# EAGLE design Loginator 1.1 (EAGLE 6.5.0)
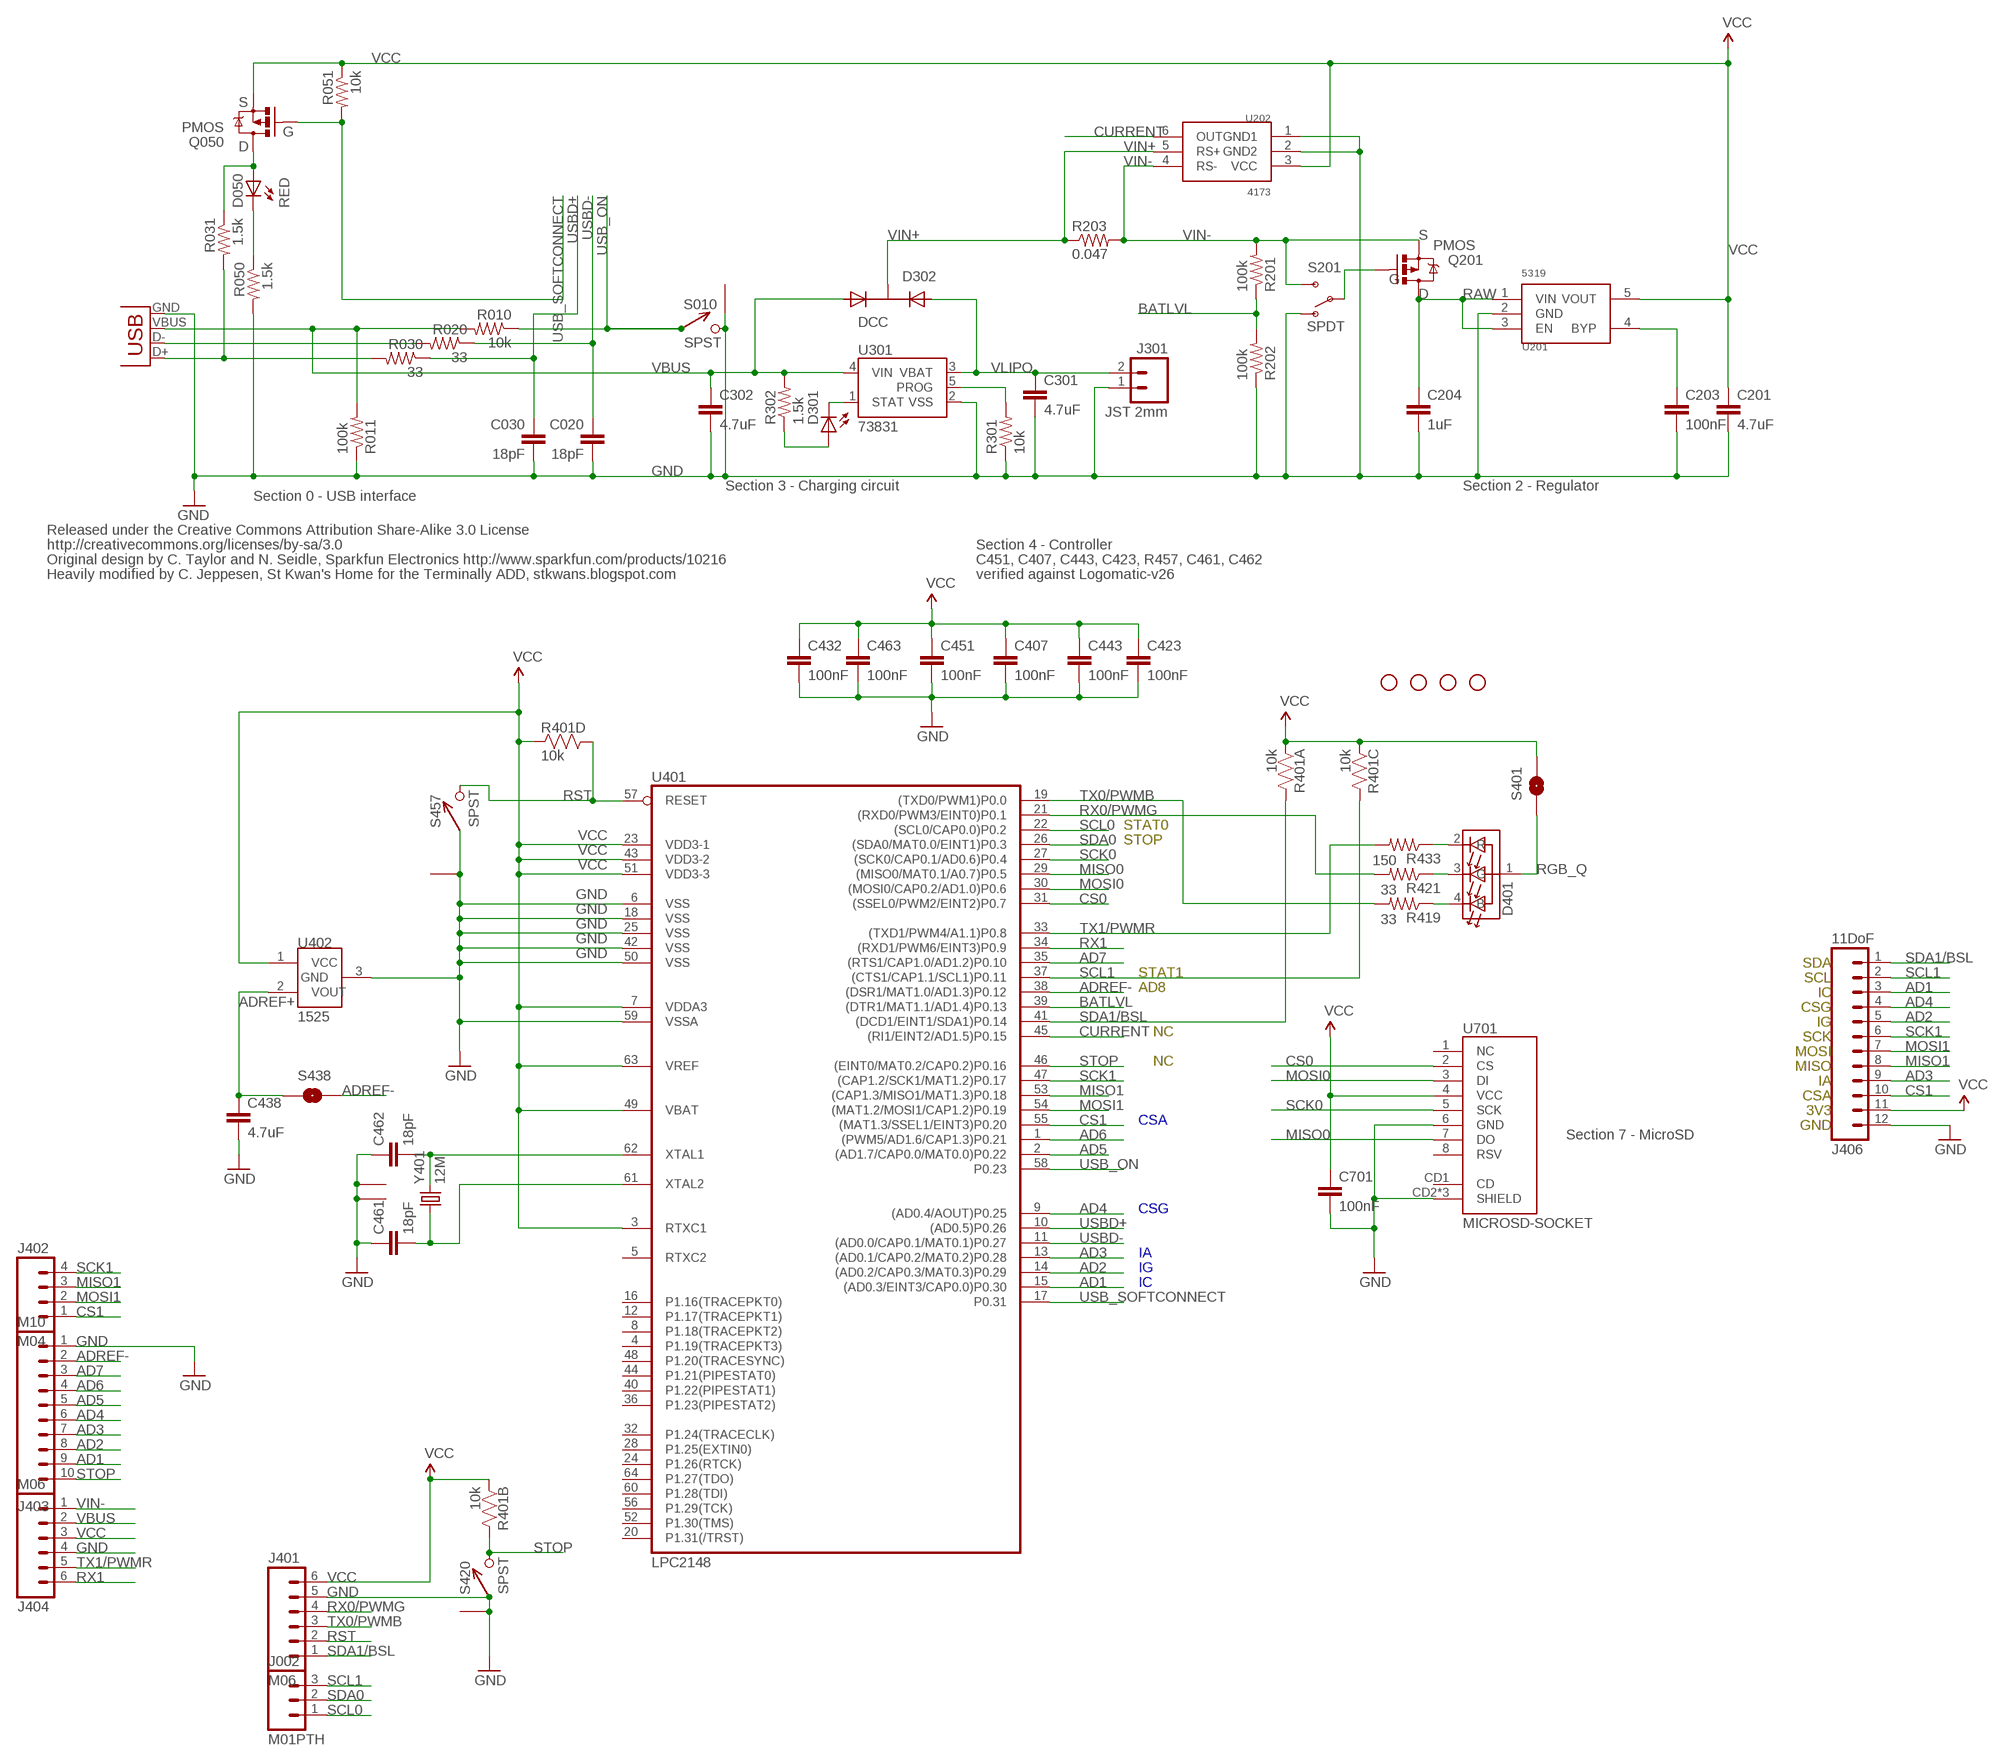
[diagram p0: schematic, sheet 1]

## Parts
C020  18pF  CAP0402-CAP  [0402-CAP]
C030  18pF  CAP0402-CAP  [0402-CAP]
C201  4.7uF  CAP0402-CAP  [0402-CAP]
C203  100nF  CAP0402-CAP  [0402-CAP]
C204  1uF  CAP0402-CAP  [0402-CAP]
C301  4.7uF  CAP0402-CAP  [0402-CAP]
C302  4.7uF  CAP0402-CAP  [0402-CAP]
C407  100nF  CAP0402-CAP  [0402-CAP]
C423  100nF  CAP0402-CAP  [0402-CAP]
C432  100nF  CAP0402-CAP  [0402-CAP]
C438  4.7uF  CAP0402-CAP  [0402-CAP]
C443  100nF  CAP0402-CAP  [0402-CAP]
C451  100nF  CAP0402-CAP  [0402-CAP]
C461  18pF  CAP0402-CAP  [0402-CAP]
C462  18pF  CAP0402-CAP  [0402-CAP]
C463  100nF  CAP0402-CAP  [0402-CAP]
C701  100nF  CAP0402-CAP  [0402-CAP]
D050  RED  LED0603  [LED-0603]
D301  RED  LED0603  [LED-0603]
D302  DCC  PMEG2005CT  [SOT-23-3]
D401  HSMF-C118  [HSMF-C118]
J001  USBSMD  [USB-MINIB]
J002  M01PTH  M03PTH  [1X03]
J301  JST 2mm  M02-JST-2MM-SMT  [JST-2-SMD]
J401  M06  M06SIP  [1X06]
J402  M04  M04PTH  [1X04]
J403  M10  M10"  [1X10]
J404  M06  M06SIP  [1X06]
J406  11DoF  M12PTH  [1X12]
JP1  STAND-OFF  [STAND-OFF]
JP2  STAND-OFF  [STAND-OFF]
JP3  STAND-OFF  [STAND-OFF]
JP4  STAND-OFF  [STAND-OFF]
Q050  PMOS  MOSFET-PCHANNELSMD  [SOT23-3]
Q201  PMOS  MOSFET-PCHANNELSMD  [SOT23-3]
R010  10k  RESISTOR0402-RES  [0402-RES]
R011  100k  RESISTOR0402-RES  [0402-RES]
R020  33  RESISTOR0402-RES  [0402-RES]
R030  33  RESISTOR0402-RES  [0402-RES]
R031  1.5k  RESISTOR0402-RES  [0402-RES]
R050  1.5k  RESISTOR0402-RES  [0402-RES]
R051  10k  RESISTOR0402-RES  [0402-RES]
R201  100k  RESISTOR0402-RES  [0402-RES]
R202  100k  RESISTOR0402-RES  [0402-RES]
R203  0.047  RESISTOR0402-RES  [0402-RES]
R301  10k  RESISTOR0402-RES  [0402-RES]
R302  1.5k  RESISTOR0402-RES  [0402-RES]
R401  10k  RP404  [CRA04]
R419  33  RESISTOR0402-RES  [0402-RES]
R421  33  RESISTOR0402-RES  [0402-RES]
R433  150  RESISTOR0402-RES  [0402-RES]
S010  SPST  B3U-1100P  [B3U-1100P]
S201  SPDT  SWITCH-SPSTSMD  [AYZ0202]
S401  SOLDERJUMPERNO  [SJ_2S-NO]
S420  SPST  B3U-1100P  [B3U-1100P]
S438  SOLDERJUMPERNO  [SJ_2S-NO]
S457  SPST  B3U-1100P  [B3U-1100P]
U201  5319  MIC5319D5  [SOT-23-5]
U202  4173  MAX4173  [SOT-23-6]
U301  73831  MCP73831  [SOT23-5]
U401  LPC2148  LPC213X  [SQFP-S-10X10-64]
U402  1525  MCP1525  [SOT-23-3]
U701  MICROSD-SOCKET  [MICROSD-SOCKET-PP]
Y401  12M  TSX-3225  [CRYSTAL_SMD]

## Nets
AD1: J403.9 J406.3 U401.15((AD0.3/EINT3/CAP0.0)P0.30)
AD2: J403.8 J406.5 U401.14((AD0.2/CAP0.3/MAT0.3)P0.29)
AD3: J403.7 J406.9 U401.13((AD0.1/CAP0.2/MAT0.2)P0.28)
AD4: J403.6 J406.4 U401.9((AD0.4/AOUT)P0.25)
AD5: J403.5 U401.2((AD1.7/CAP0.0/MAT0.0)P0.22)
AD6: J403.4 U401.1((PWM5/AD1.6/CAP1.3)P0.21)
AD7: J403.3 U401.35((RTS1/CAP1.0/AD1.2)P0.10)
ADREF+: C438.1 S438.1 U402.2(VOUT)
ADREF-: J403.2 S438.2 U401.38((DSR1/MAT1.0/AD1.3)P0.12)
BATLVL: R201.1 R202.2 U401.39((DTR1/MAT1.1/AD1.4)P0.13)
CONN_D+: J001.D+ R030.2 R031.2
CONN_D-: J001.D- R020.2
CS0: U401.31((SSEL0/PWM2/EINT2)P0.7) U701.2(CS)
CS1: J402.1 J406.10 U401.55((MAT1.3/SSEL1/EINT3)P0.20)
CURRENT: U202.6(OUT) U401.45((RI1/EINT2/AD1.5)P0.15)
DB: D401.4(B) R419.1
DG: D401.3(G) R421.1
DR: D401.2(R) R433.1
GND: C020.2 C030.2 C201.2 C203.2 C204.2 C301.2 C302.2 C407.2 C423.2 C432.2 C438.2 C443.2 C451.2 C461.1 C462.1 C463.2 C701.2 J001.GND J301.1 J401.5 J403.1 J404.4 J406.12 R011.1 R050.2 R202.1 R301.1 S010.P$2 S010.P$3 S201.1(O) S420.P$1 S420.P$3 S457.P$1 S457.P$3 U201.2(GND) U202.1(GND1) U202.2(GND2) U301.2(VSS) U401.6(VSS) U401.18(VSS) U401.25(VSS) U401.42(VSS) U401.50(VSS) U401.59(VSSA) U402.3(GND) U701.6(GND) U701.CD2(SHIELD) U701.GND1(SHIELD) U701.GND3(SHIELD) Y401.2 Y401.4
MISO0: U401.29((MISO0/MAT0.1/A0.7)P0.5) U701.7(DO)
MISO1: J402.3 J406.8 U401.53((CAP1.3/MISO1/MAT1.3)P0.18)
MOSI0: U401.30((MOSI0/CAP0.2/AD1.0)P0.6) U701.3(DI)
MOSI1: J402.2 J406.7 U401.54((MAT1.2/MOSI1/CAP1.2)P0.19)
N$1: D301.A R302.1
N$2: R301.2 U301.5(PROG)
N$3: D301.C U301.1(STAT)
N$6: D050.A Q050.3(D) R031.1
N$7: D050.C R050.1
N$10: Q201.1(G) S201.2(P)
N$17: C203.1 U201.4(BYP)
RAW: C204.1 Q201.3(D) U201.1(VIN) U201.3(EN)
RGB_Q: D401.1(A) S401.1
RST: J401.2 R401.5 S457.P$2 U401.57(RESET)
RX0/PWMG: J401.4 R421.2 U401.21((RXD0/PWM3/EINT0)P0.1)
RX1: J404.6 U401.34((RXD1/PWM6/EINT3)P0.9)
SCK0: U401.27((SCK0/CAP0.1/AD0.6)P0.4) U701.5(SCK)
SCK1: J402.4 J406.6 U401.47((CAP1.2/SCK1/MAT1.2)P0.17)
SCL0: J002.1 U401.22((SCL0/CAP0.0)P0.2)
SCL1: J002.3 J406.2 R401.6 U401.37((CTS1/CAP1.1/SCL1)P0.11)
SDA0: J002.2 U401.26((SDA0/MAT0.0/EINT1)P0.3)
SDA1/BSL: J401.1 J406.1 R401.8 U401.41((DCD1/EINT1/SDA1)P0.14)
STOP: J403.10 R401.7 S420.P$2 U401.46((EINT0/MAT0.2/CAP0.2)P0.16)
TX0/PWMB: J401.3 R419.2 U401.19((TXD0/PWM1)P0.0)
TX1/PWMR: J404.5 R433.2 U401.33((TXD1/PWM4/A1.1)P0.8)
USB_ON: R010.1 S010.P$1 U401.58(P0.23)
USB_SOFTCONNECT: Q050.1(G) R051.2 U401.17(P0.31)
USBD+: C030.1 R030.1 U401.10((AD0.5)P0.26)
USBD-: C020.1 R020.1 U401.11((AD0.0/CAP0.1/MAT0.1)P0.27)
VBUS [power]: C302.1 D302.1(A1) J001.VBUS J404.2 R010.2 R011.2 R302.2 U301.4(VIN)
VCC: C201.1 C407.1 C423.1 C432.1 C443.1 C451.1 C463.1 C701.1 J401.6 J404.3 J406.11 Q050.2(S) R051.1 R401.1 R401.2 R401.3 R401.4 S401.2 U201.5(VOUT) U202.3(VCC) U401.3(RTXC1) U401.7(VDDA3) U401.23(VDD3-1) U401.43(VDD3-2) U401.49(VBAT) U401.51(VDD3-3) U401.63(VREF) U402.1(VCC) U701.4(VCC)
VIN+: D302.3(K) R203.1 U202.5(RS+)
VIN-: J404.1 Q201.2(S) R201.2 R203.2 S201.3(S) U202.4(RS-)
VLIPO [power]: C301.1 D302.2(A2) J301.2 U301.3(VBAT)
XTAL1: C462.2 U401.62(XTAL1) Y401.3
XTAL2: C461.2 U401.61(XTAL2) Y401.1
Unconnected: U401.4(P1.19(TRACEPKT3)) U401.5(RTXC2) U401.8(P1.18(TRACEPKT2)) U401.12(P1.17(TRACEPKT1)) U401.16(P1.16(TRACEPKT0)) U401.20(P1.31(/TRST)) U401.24(P1.26(RTCK)) U401.28(P1.25(EXTIN0)) U401.32(P1.24(TRACECLK)) U401.36(P1.23(PIPESTAT2)) U401.40(P1.22(PIPESTAT1)) U401.44(P1.21(PIPESTAT0)) U401.48(P1.20(TRACESYNC)) U401.52(P1.30(TMS)) U401.56(P1.29(TCK)) U401.60(P1.28(TDI)) U401.64(P1.27(TDO)) U701.1(NC) U701.8(RSV) U701.CD1(CD)

## Notes on the sheet
- S
- G
- D
- S
- G
- D
- Section 0 - USB interface | Section 3 - Charging circuit | Section 2 - Regulator
- Released under the Creative Commons Attribution Share-Alike 3.0 License
- http://creativecommons.org/licenses/by-sa/3.0 | Section 4 - Controller
- Original design by C. Taylor and N. Seidle, Sparkfun Electronics http://www.sparkfun.com/products/10216 | C451, C407, C443, C423, R457, C461, C462
- Heavily modified by C. Jeppesen, St Kwan's Home for the Terminally ADD, stkwans.blogspot.com | verified against Logomatic-v26
- STAT0
- STOP
- SDA
- STAT1 | SCL
- AD8 | IC
- CSG
- IG
- NC | SCK
- MOSI
- NC | MISO
- IA
- CSA
- 3V3
- CSA | GND
- Section 7 - MicroSD
- CSG
- IA
- IG
- IC

## Library data of the parts
C020 C030 C201 C203 C204 C301 C302 C407 C423 C432 C438 C443 C451 C461-C463 C701 = SparkFun:CAP: Capacitor Standard 0603 ceramic capacitor, and 0.1" leaded capacitor.
D050 D301 = SparkFun:LED: LEDs Standard schematic elements and footprints for 5mm, 3mm, 1206, and 0603 sized LEDs. 5mm - Spark Fun Electronics SKU : COM-00529 (and others)
D302 = KwanSystems:PMEG2005CT
D401 = KwanSystems:HSMF-C118
J001 = SparkFun:USB: USB Connectors USB-B-PTH is fully proven SKU : PRT-00139 USB-miniB is fully proven SKU : PRT-00587 USB-A-PCB is untested. USB-A-H is throughly reviewed, but untested. Spark Fun Electronics SKU : PRT-00437 USB-B-SMT is throughly reviewed, but untested. Needs silkscreen touching up. USB-A-S has not been used/tested USB-MB-H has not been used/tested
J002 = SparkFun:M03: Header 3 Standard 3-pin 0.1" header. Use with straight break away headers (SKU : PRT-00116), right angle break away headers (PRT-00553), swiss pins (PRT-00743), machine pins (PRT-00117), and female headers (PRT-00115). Molex polarized connector foot print use with SKU : PRT-08232 with associated crimp pins and housings.
J301 = SparkFun:M02: Header 2 Standard 2-pin 0.1" header. Use with straight break away headers (SKU : PRT-00116), right angle break away headers (PRT-00553), swiss pins (PRT-00743), machine pins (PRT-00117), and female headers (PRT-00115). Molex polarized connector foot print use with SKU : PRT-08233 with associated crimp pins and housings.
J401 J404 = SparkFun:M06: Header 6 Standard 6-pin 0.1" header. Use with straight break away headers (SKU : PRT-00116), right angle break away headers (PRT-00553), swiss pins (PRT-00743), machine pins (PRT-00117), and female headers (PRT-00115). Molex polarized connector foot print use with SKU : PRT-08094 with associated crimp pins and housings. NOTES ON THE VARIANTS LOCK and LOCK_LONGPADS... This footprint was designed to help hold the alignment of a through-hole component (i.e. 6-pin header) while soldering it into place. You may notice that each hole has been shifted either up or down by 0.005 of an inch from it's more standard position (which is a perfectly straight line). This slight alteration caused the pins (the squares in the middle) to touch the edges of the holes. Because they are alternating, it causes a "brace" to hold the component in place. 0.005 has proven to be the perfect amount of "off-center" position when using our standard breakaway headers. Although looks a little odd when you look at the bare footprint, once you have a header in there, the alteration is very hard to notice. Also, if you push a header all the way into place, it is covered up entirely on the bottom side. This idea of altering the position of holes to aid alignment will be further integrated into the Sparkfun Library for other footprints. It can help hold any component with 3 or more connection pins.
J402 = SparkFun:M04: Header 4 Standard 4-pin 0.1" header. Use with straight break away headers (SKU : PRT-00116), right angle break away headers (PRT-00553), swiss pins (PRT-00743), machine pins (PRT-00117), and female headers (PRT-00115). Molex polarized connector foot print use with SKU : PRT-08231 with associated crimp pins and housings. 1MM SMD Version SKU: PRT-10208
J403 = SparkFun:M10: Header 10 Standard 10-pin 0.1" header. Use with straight break away headers (SKU : PRT-00116), right angle break away headers (PRT-00553), swiss pins (PRT-00743), machine pins (PRT-00117), and female headers (PRT-00115).
J406 = SparkFun:M12: Header 12 Standard 12-pin 0.1" header. Use with straight break away headers (SKU : PRT-00116), right angle break away headers (PRT-00553), swiss pins (PRT-00743), machine pins (PRT-00117), and female headers (PRT-00115).
JP1-JP4 = SparkFun:STAND-OFF: Stand Off This is the mechanical footprint for a #4 phillips button head screw. Use the keepout ring to avoid running the screw head into surrounding components. SKU : PRT-00447
Q050 Q201 = SparkFun:MOSFET-PCHANNEL
R010 R011 R020 R030 R031 R050 R051 R201-R203 R301 R302 R419 R421 R433 = SparkFun:RESISTOR: Resistor Basic schematic elements and footprints for 0603, 1206, and PTH resistors.
R401 = KwanSystems:RP4
S010 S420 S457 = KwanSystems:B3U-1100P
S201 = SparkFun:SWITCH-SPST: SPST Switch Simple slide switch. Spark Fun Electronics SKU : COM-00102
S401 S438 = SparkFun:SOLDERJUMPER: Solder Jumper Standard SMD solder jumper. Used to automate production. Two varients : Normally Open and Normally Closed are the same, but have different paste layers. NC will have a large amount of paste and should jumper during reflow.
U201 = KwanSystems:MIC5319
U202 = KwanSystems:MAX4173
U301 = SparkFun:MCP73831: Microchip's MCP73831 Miniature single cell, fully integrated Li-Ion, Li-polymer charge management controller http://ww1.microchip.com/downloads/en/DeviceDoc/21984a.pdf
U401 = SparkFun:LPC213X: LPC213x Schematic element and footprint for NXP LPC213x. Spark Fun Electronics SKU : COM-00520
U402 = KwanSystems:MCP1525
U701 = KwanSystems:MICROSD-SOCKET: microSD Socket Push-push type uSD socket. Digikey 101-00660-68-6-1-ND. tDoc lines correctly indicate media card edge positions when inserting (unlocked, locked, depressed).
Y401 = KwanSystems:TSX-3225

## Net classes
0 default: width 0.152 mm, drill 0.33 mm, clearance 0.152 mm
1 power: width 0.152 mm, drill 0.33 mm, clearance 0.152 mm to class 0, clearance 0.152 mm
2 hv: width 0.152 mm, drill 0.33 mm, clearance 0.152 mm to class 0, clearance 0.152 mm to class 1, clearance 0.152 mm

## Board
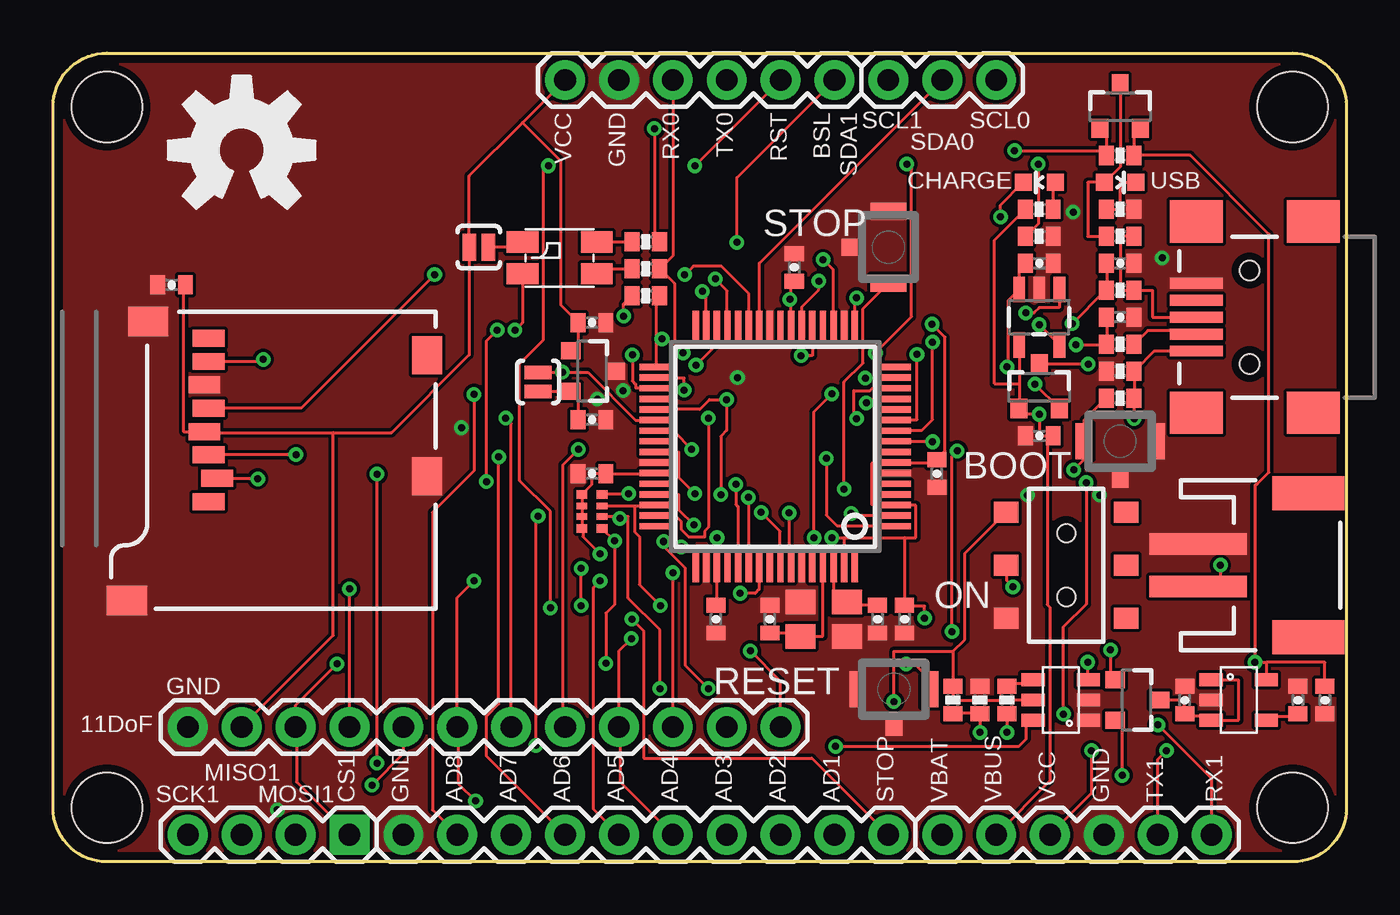
[diagram p1: board, top side]
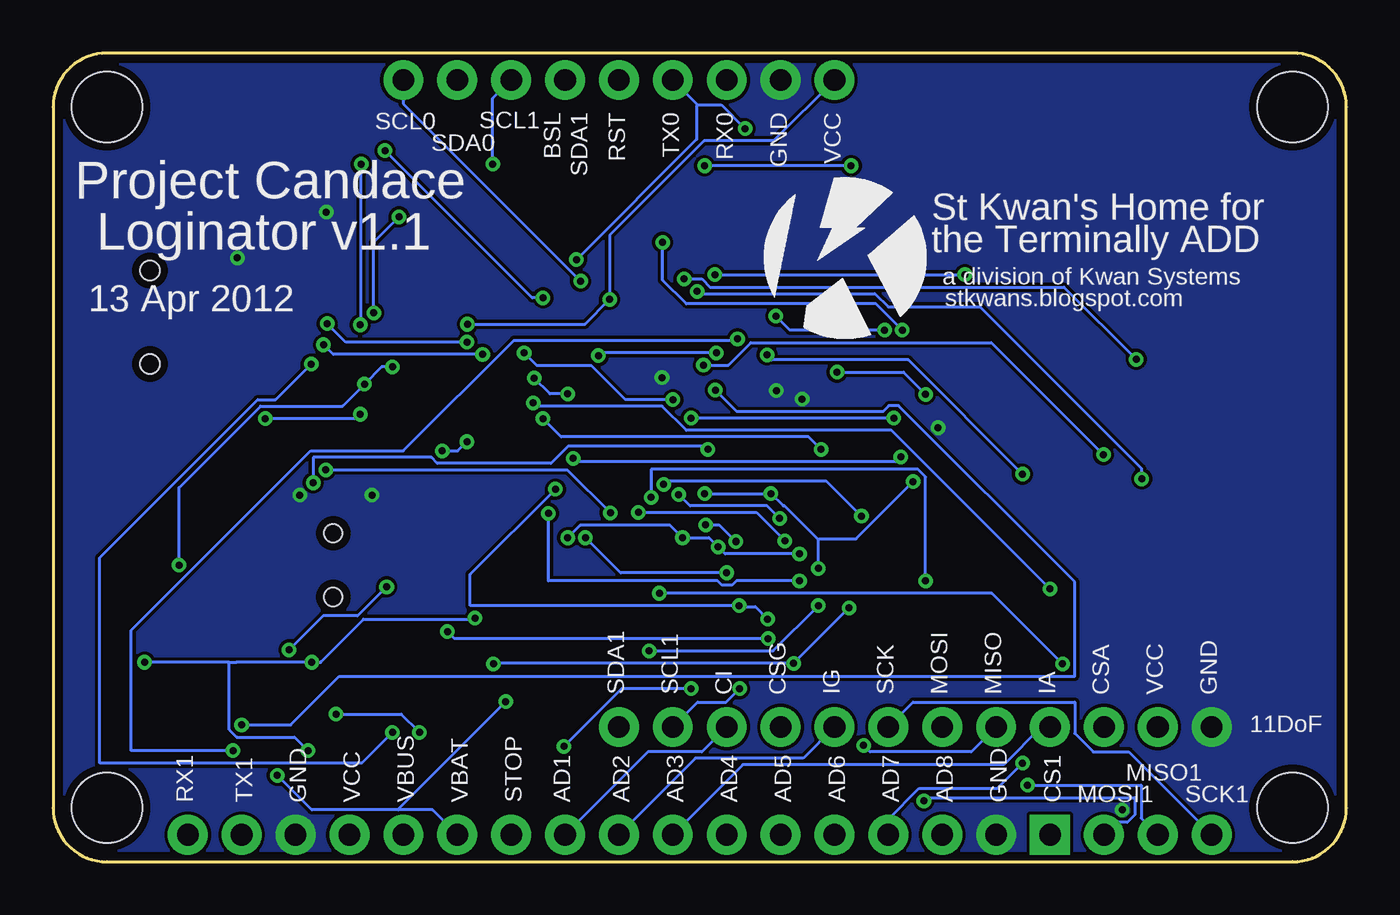
[diagram p2: board, bottom side, seen from below]

Size 60.96 x 38.1 mm. Coordinates in mm from the lower left corner, seen from the top.
Outline: 2.54,38.1 58.42,38.1 arc-90 60.96,35.56 60.96,2.54 arc-90 58.42,0 2.54,0 arc-90 0,2.54 0,35.56 arc-90 2.54,38.1
Copper layers (1*16): Top 0.0356mm / dielectric 1.5011mm / Bottom 0.0356mm
Design rules: minimum track width 6mil, minimum drill 13mil, track to track 6mil, track to pad 6mil, pad to pad 6mil, via to via 6mil, smd to smd 6mil, copper to edge 15mil, drill to drill 6mil, minimum pad ring 7mil, minimum via ring 7mil, stop-mask expansion 4mil, vias tented up to drill 14mil, thermal gap 10mil
vRestrict: area 4.8,2.8 to 7.6,3.6; area 7.1,3.8 to 10.4,4.6; area 9.4,2.8 to 13,3.6; area 13.2,2.8 to 14.5,4.8; area 15.7,2.8 to 17,4.8; area 18.3,2.8 to 19.6,4.8; area 20.8,2.8 to 22.1,4.8; area 23.4,2.8 to 24.6,4.8; area 25.9,2.8 to 27.2,4.8; area 28.4,2.8 to 29.7,4.8; area 31,2.8 to 32.3,4.8; area 33.5,2.8 to 34.8,4.8; 44 more areas

### Footprints (pad centres in the part's own frame; a part is rotated, then mirrored left to right if it is on the bottom)
0402-CAP = smd 0.7 x 0.9: 1 -0.65,0; 2 0.65,0
LED-0603 = smd 0.8 x 0.8: A 0,-0.75; C 0,0.75
SOT-23-3 = smd 0.9 x 0.8: 1 -1,0.95; 2 -1,-0.95; 3 1.1,0
HSMF-C118 = smd 1.5 x 1: 1 1.75,-0.75; 2 1.75,0.75; 3 -1.75,0.75; 4 -1.75,-0.75
USB-MINIB = smd 2.5 x 0.5: D+ 2.5,0; D- 2.5,0.8; GND 2.5,-1.6; ID 2.5,-0.8; VBUS 2.5,1.6 | smd 2.5 x 2: MTN1 -3,4.5; MTN2 2.5,4.5; MTN3 -3,-4.5; MTN4 2.5,-4.5 | hole 0.9: 0,2.2; 0,-2.2
1X03 = drill 1.016 pad 1.88: 1 0,0; 2 2.54,0; 3 5.08,0
JST-2-SMD = smd 1 x 4.6: 1 -1,-3.7; 2 1,-3.7 | smd 1.6 x 3.4: NC1 -3.4,1.5; NC2 3.4,1.5
1X06 = drill 1.016 pad 1.88: 1 0,0; 2 2.54,0; 3 5.08,0; 4 7.62,0; 5 10.16,0; 6 12.7,0
1X04 = drill 1.016 pad 1.88 square: 1 0,0 | drill 1.016 pad 1.88: 2 2.54,0; 3 5.08,0; 4 7.62,0
1X10 = drill 1.016 pad 1.88: 1 0,0; 2 2.54,0; 3 5.08,0; 4 7.62,0; 5 10.16,0; 6 12.7,0; 7 15.24,0; 8 17.78,0; 9 20.32,0; 10 22.86,0
1X12 = drill 1.016 pad 1.88: 1 0,0; 2 2.54,0; 3 5.08,0; 4 7.62,0; 5 10.16,0; 6 12.7,0; 7 15.24,0; 8 17.78,0; 9 20.32,0; 10 22.86,0; 11 25.4,0; 12 27.94,0
STAND-OFF = hole 3.302: 0,0
SOT23-3 = smd 0.8 x 0.9: 1 -0.95,-1; 2 0.95,-1; 3 0,1.1
0402-RES = smd 0.7 x 0.9: 1 -0.65,0; 2 0.65,0
CRA04 = smd 0.4 x 0.5: 1 -0.8,-0.475; 4 0.8,-0.475; 5 0.8,0.475; 8 -0.8,0.475 | smd 0.3 x 0.5: 2 -0.25,-0.475; 3 0.25,-0.475; 6 0.25,0.475; 7 -0.25,0.475
B3U-1100P = smd 0.8 x 1.7: P$1 -1.7,0; P$2 1.7,0 | smd 0.8 x 1.1: P$3 0,-1.65
AYZ0202 = smd 1 x 1.15: 1 -2.5,2.825; 2 0,2.825; 3 2.5,2.825; 4 -2.5,-2.825; 5 0,-2.825; 6 2.5,-2.825 | hole 0.85: 1.5,0; -1.5,0
SJ_2S-NO = smd 0.635 x 1.27: 1 -0.45,0; 2 0.45,0
SOT-23-5 = smd 0.6 x 1.1: 1 -0.95,-1.3; 2 0,-1.3; 3 0.95,-1.3; 4 0.95,1.3; 5 -0.95,1.3
SOT-23-6 = smd 0.6 x 1.1: 1 -0.95,-1.3; 2 0,-1.3; 3 0.95,-1.3; 4 0.95,1.3; 5 0,1.3; 6 -0.95,1.3
SOT23-5 = smd 0.55 x 1.2: 1 -0.95,-1.3; 2 0,-1.3; 3 0.95,-1.3; 4 0.95,1.3; 5 -0.95,1.3
SQFP-S-10X10-64 = smd 0.3 x 1.6: 1 -3.75,-5.6; 2 -3.25,-5.6; 3 -2.75,-5.6; 4 -2.25,-5.6; 5 -1.75,-5.6; 6 -1.25,-5.6; 7 -0.75,-5.6; 8 -0.25,-5.6; 9 0.25,-5.6; 10 0.75,-5.6; 11 1.25,-5.6; 12 1.75,-5.6; 13 2.25,-5.6; 14 2.75,-5.6; 15 3.25,-5.6; 16 3.75,-5.6; 33 3.75,5.6; 34 3.25,5.6; 35 2.75,5.6; 36 2.25,5.6; 37 1.75,5.6; 38 1.25,5.6; 39 0.75,5.6; 40 0.25,5.6; 41 -0.25,5.6; 42 -0.75,5.6; 43 -1.25,5.6; 44 -1.75,5.6; 45 -2.25,5.6; 46 -2.75,5.6; 47 -3.25,5.6; 48 -3.75,5.6 | smd 1.6 x 0.3: 17 5.6,-3.75; 18 5.6,-3.25; 19 5.6,-2.75; 20 5.6,-2.25; 21 5.6,-1.75; 22 5.6,-1.25; 23 5.6,-0.75; 24 5.6,-0.25; 25 5.6,0.25; 26 5.6,0.75; 27 5.6,1.25; 28 5.6,1.75; 29 5.6,2.25; 30 5.6,2.75; 31 5.6,3.25; 32 5.6,3.75; 49 -5.6,3.75; 50 -5.6,3.25; 51 -5.6,2.75; 52 -5.6,2.25; 53 -5.6,1.75; 54 -5.6,1.25; 55 -5.6,0.75; 56 -5.6,0.25; 57 -5.6,-0.25; 58 -5.6,-0.75; 59 -5.6,-1.25; 60 -5.6,-1.75; 61 -5.6,-2.25; 62 -5.6,-2.75; 63 -5.6,-3.25; 64 -5.6,-3.75
MICROSD-SOCKET-PP = smd 0.8 x 1.5: 1 -8.94,10.7; 2 -7.84,10.3; 3 -6.74,10.7; 4 -5.64,10.9; 5 -4.54,10.7; 6 -3.44,10.9; 7 -2.34,10.7; 8 -1.24,10.7 | smd 1.8 x 1.4: CD1 -2.05,0.4; CD2 -7.75,0.4 | smd 1.4 x 1.9: GND1 -13.6,14.55; GND3 -0.45,13.55
CRYSTAL_SMD = smd 1.4 x 1.15: 1 -1.092,-0.813; 2 1.092,-0.813; 3 1.092,0.813; 4 -1.092,0.813

### Placement (x,y rotation side)
C020  50.29,25.65 0 top
C030  50.29,28.19 0 top
C201  59.94,7.62 270 top
C203  58.67,7.62 90 top
C204  53.34,7.62 90 top
C301  46.48,28.19 0 top
C302  46.48,20.07 180 top
C407  41.66,18.29 270 top
C423  34.93,28 90 top
C432  25.4,25.4 0 top
C438  25.4,20.83 0 top
C443  25.4,18.29 180 top
C451  31.24,11.43 270 top
C461  33.78,11.43 270 top
C462  38.86,11.43 90 top
C463  40.13,11.43 270 top
C701  5.59,27.18 180 top
D050  50.29,32 270 top
D301  46.48,32 90 top
D302  46.48,22.35 90 top
D401  23.88,28.45 180 top
J001  56.39,25.65 180 top
J002  44.45,36.83 180 top
J301  57.66,13.97 270 top
J401  36.83,36.83 180 top
J402  13.97,1.27 180 top
J403  16.51,1.27 0 top
J404  41.91,1.27 0 top
J406  34.29,6.35 180 top
JP1  2.54,2.54 0 top
JP2  58.42,2.54 0 top
JP3  2.54,35.56 0 top
JP4  58.42,35.56 0 top
Q050  50.29,35.56 0 top
Q201  51.05,7.62 270 top
R010  50.29,21.84 0 top
R011  50.29,23.11 0 top
R020  50.29,24.38 0 top
R030  50.29,26.92 0 top
R031  50.29,29.46 0 top
R050  50.29,30.73 0 top
R051  50.29,33.27 180 top
R201  42.42,7.62 90 top
R202  43.69,7.62 270 top
R203  44.96,7.62 90 top
R301  46.48,29.46 180 top
R302  46.48,30.73 180 top
R401  25.4,16.51 270 top
R419  27.94,29.21 0 top
R421  27.94,27.94 0 top
R433  27.94,26.67 0 top
S010  50.29,19.81 0 top
S201  47.75,13.97 90 top
S401  20.07,28.96 180 top
S420  39.37,28.96 270 top
S438  22.86,22.61 90 top
S457  39.62,8.13 0 top
U201  55.88,7.62 270 top
U202  47.5,7.62 90 top
U301  46.48,25.65 180 top
U401  34.04,19.56 90 top
U402  25.4,23.11 0 top
U701  18.03,25.91 90 top
U$1  [KWAN_CIRCLE]  23.62,28.45 0 bottom
U$2  [OSHW-LOGO-L]  8.89,33.53 0 top
Y401  36.32,11.43 0 top

### Tracks (layer width: path | path; a pad name or v marks a point on that pad's centre or on a via)
AD1  (via drill 0.33)
  Top 0.152: v38.28,22.78 39.62,22.78 U401.15 | v36.7,22.05 35.87,21.21 v35.87,15.27 | J406.3 v29.21,13.61
  Bottom 0.152: v38.28,22.78 37.54,22.05 v36.7,22.05 | v35.87,15.27 34.21,13.61 v29.21,13.61 | J403.9 32.92,5.18 30.38,5.18 J406.3
AD2  (via drill 0.33)
  Top 0.152: v37.87,20.88 37.74,21.01 37.74,22.2 38.51,22.2 38.61,22.3 39.62,22.3 U401.14 | v24.77,19.43 24.03,18.69 24.03,6.45 J406.5
  Bottom 0.152: v37.87,20.88 37.01,20.02 25.35,20.02 v24.77,19.43 | J403.8 30.68,4.88 25.6,4.88 J406.5
AD3  (via drill 0.33)
  Top 0.152: v38.33,21.61 38.33,21.79 39.62,21.79 U401.13 | J406.9 v13.97,12.85
  Bottom 0.152: v38.33,21.61 38.18,21.46 32.26,21.46 31.11,20.32 21.44,20.32 v13.97,12.85 | J403.7 28.45,4.57 16.15,4.57 14.38,6.35 J406.9
AD4  (via drill 0.33)
  Top 0.152: v41.45,19.79 39.65,19.79 U401.9 | v42.62,19.36 42.37,19.1 v42.37,10.85 | v27.25,10.52 26.67,9.93 J406.4 26.72,6.3 26.72,3.76 J403.6
  Bottom 0.152: v41.45,19.79 41.88,19.36 v42.62,19.36 | v42.37,10.85 42.04,10.52 v27.25,10.52
AD5  (via drill 0.33)
  Top 0.152: v37.62,16.41 37.62,16.33 39.62,16.33 U401.2 | v25.78,13.23 25.48,12.93 25.48,2.46 J403.5
  Bottom 0.152: v37.62,16.41 37.62,13.23 29.64,13.23 29.44,13.03 28.96,13.03 28.75,13.23 v25.78,13.23
AD6  (via drill 0.33)
  Top 0.152: v36.45,19 36.45,16.33 36.96,15.82 39.62,15.82 U401.1 | v21.01,19.07 21.01,7.44 20.42,6.86 20.42,4.98 J403.4
  Bottom 0.152: v36.45,19 36.3,18.85 21.23,18.85 v21.01,19.07
AD7  (via drill 0.33)
  Top 0.152: v27.3,23.88 27.3,22.66 27.46,22.5 27.46,22.33 28.42,22.33 U401.35 | v15.27,4.65 v15.27,18.26
  Bottom 0.152: v27.3,23.88 27.08,23.65 20.65,23.65 v15.27,18.26 | v15.27,4.65 16.46,3.45 20.14,3.45 21.59,2.01 J403.3
ADREF+
  Top 0.152: C438.1 24.75,21.81 arc90 U402.2 S438.1 arc90 S438.1
ADREF-  (via drill 0.33)
  Top 0.152: S438.2 v24,23.06 | v24,23.06 25.2,23.06 27.45,20.81 U401.38 | J403.2 17.88,2.44 17.88,16.46 19.84,18.41 v19.84,22.02 | v24,23.06
  Bottom 0.152: v19.84,22.02 20.88,23.06 v24,23.06
BATLVL  (via drill 0.33)
  Top 0.152: R201.1 42.42,6.99 43.69,6.99 R202.2 43.71,6.91 43.69,6.91 v43.69,6.1 | v48.69,17.86 48.69,12.14 47.62,11.07 v47.62,6.96 | v30.1,19.43 29.23,20.3 28.45,20.3 U401.39
  Bottom 0.152: v47.62,6.96 44.55,6.96 v43.69,6.1 | v48.69,17.86 48.69,19.05 43.13,19.05 42.85,18.77 37.49,18.77 36.68,19.58 30.25,19.58 v30.1,19.43
CONN_D+
  Top 0.152: 50.95,29.46 R031.2 50.29,29.46 50.29,26.92 R030.2 51.82,26.92 51.82,25.65 J001.D+
CONN_D-
  Top 0.152: R020.2 50.95,24.38 51.59,25.02 53.87,25.02 53.87,24.87 J001.D-
CS0  (via drill 0.33)
  Top 0.152: v30.61,26.87 30.79,26.7 U401.31 | 7.72,18.09 U701.2 9.62,18.07 v9.65,18.03
  Bottom 0.152: v30.61,26.87 30.5,26.77 22.23,26.77 21.59,26.14 17.27,26.14 9.65,18.52 v9.65,18.03
CS1  (via drill 0.33)
  Top 0.152: v13.39,9.32 11.43,7.37 J406.10 11.48,6.3 11.48,3.76 J402.1 | U401.55 33.27,13.95 33.27,12.83 33.1,12.65 v32.38,12.65
  Bottom 0.152: v32.38,12.65 16.71,12.65 v13.39,9.32
CURRENT  (via drill 0.33)
  Top 0.152: v36.88,5.44 45.52,5.44 45.87,5.79 45.87,6.35 46.18,6.66 U202.6 | v30.89,8.15 29.79,9.25 29.79,13.84 28.78,14.86 v28.78,15.09 | v30.2,15.88 29.49,16.59 29.49,17.3 28.45,17.3 U401.45
  Bottom 0.152: v36.88,5.44 34.16,8.15 v30.89,8.15 | v28.78,15.09 29.57,15.88 v30.2,15.88
DB
  Top 0.152: R419.1 D401.4
DG
  Top 0.152: R421.1 25.63,27.94 D401.3
DR  (via drill 0.33)
  Top 0.152: v26.9,25.7 26.9,26.29 R433.1 | v21.77,25.04 22.12,25.4 22.12,27.69 D401.2
  Bottom 0.152: v26.9,25.7 26.24,25.04 v21.77,25.04
GND  (via drill 0.33)
  other vias: 10.57,2.44 25.65,21.79 26.87,22.2 32.26,22.81 19.25,20.45 49.33,17.27 45.92,17.27 52.27,28.45 48.08,30.61
  pour Bottom (no thermals): 2.54,38.1 58.42,38.1 arc-90 60.96,35.56 60.96,2.54 arc-90 58.42,0 2.54,0 arc-90 0,2.54 0,35.56 arc-90
  pour Top (no thermals): 2.54,38.1 58.42,38.1 arc-90 60.96,35.56 60.96,2.54 arc-90 58.42,0 2.54,0 arc-90 0,2.54 0,35.56 arc-90
MISO0  (via drill 0.33)
  Top 0.152: v31.22,27.46 31.77,26.9 31.77,25.17 U401.29 | U701.7 9.8,23.57 v9.91,23.67
  Bottom 0.152: v9.91,23.67 13.31,27.08 30,27.08 30.38,27.46 v31.22,27.46
MISO1  (via drill 0.33)
  Top 0.152: v22.86,16.28 22.76,16.18 v22.76,5.49 | v15.04,3.61 16.51,5.08 J406.8 | v32.18,17.78 32.18,16.84 32.29,16.74 U401.53
  Bottom 0.152: v32.18,17.78 32.03,17.93 24.51,17.93 v22.86,16.28 | v22.76,5.49 22.45,5.18 17.68,5.18 J406.8 | J402.3 9.68,2.06 9.68,3.61 v15.04,3.61
MOSI0  (via drill 0.33)
  Top 0.152: v11.46,19.18 7.32,19.18 U701.3 | v30.3,23.39 31.27,24.36 31.27,25.15 U401.30
  Bottom 0.152: v11.46,19.18 16.74,24.46 28.07,24.46 29.13,23.39 v30.3,23.39
MOSI1  (via drill 0.33)
  Top 0.152: v32.77,17.17 32.77,13.97 U401.54 | v19.84,13.23 19.05,12.45 J406.7 19.1,6.3 19.1,3.68 v19.91,2.87
  Bottom 0.152: v32.77,17.17 32.77,18.49 20.19,18.49 19.84,18.14 v19.84,13.23 | J402.2 10.85,1.85 10.34,1.85 9.98,2.21 9.98,3.02 19.76,3.02 v19.91,2.87
N$1
  Top 0.152: D301.A 47.14,31.93 47.14,30.73 R302.1
N$2  (via drill 0.33)
  Top 0.152: v46.43,32.87 46.43,30.05 45.85,29.46 R301.2 | v46.48,25.3 U301.5
  Bottom 0.152: v46.43,32.87 46.43,25.3 v46.48,25.3
N$3  (via drill 0.33)
  Top 0.152: v44.65,30.38 44.65,30.94 D301.C | v45.85,25.86 46.23,25.86 46.48,26.11 47.42,26.11 U301.1
  Bottom 0.152: v44.65,30.38 45.85,29.18 v45.85,25.86
N$6
  Top 0.152: Q050.3 50.29,32.74 49.55,32 D050.A | R031.1 48.77,29.46 48.77,32 D050.A | 49.55,32.11 D050.A
N$7
  Top 0.152: 50.95,31.93 D050.C 50.29,32 50.29,30.73 R050.1
N$10  (via drill 0.33)
  Top 0.152: v49.84,9.98 49.84,8.79 50.04,8.59 Q201.1 | v45.24,12.95 44.93,13.26 S201.2
  Bottom 0.152: v49.84,9.98 48.23,11.58 46.61,11.58 v45.24,12.95
N$17
  Top 0.152: C203.1 C203.1 arc-90 58.56,6.86 57.38,6.86 57.2,6.68 U201.4
RAW
  Top 0.152: C204.1 | Q201.3 53.31,7.62 53.31,7.04 C204.1 | U201.1 55.88,8.56 55.88,6.67 U201.3 54.39,6.86 53.34,6.86 C204.1
RGB_Q
  Top 0.152: 22.12,29.18 D401.1 22.13,28.96 S401.1
RST  (via drill 0.33)
  Top 0.152: v33.38,16.46 34.27,15.57 34.27,13.97 U401.57 | R401.5 25.88,15.7 v26.47,15.11 26.47,12.12 26.06,11.71 v26.06,9.35 | S457.P$2 41.3,8.13 41.3,8.61 40.59,9.32 v40.21,9.32 | v30.25,32.79 J401.2 | v23.34,32.79 23.11,32.56 23.11,24.59 22,23.47 22,17.96 23.44,16.51 v23.44,11.96
  Bottom 0.152: v26.47,15.11 27.81,16.46 v33.38,16.46 | v40.21,9.32 40.18,9.35 v26.06,9.35 v23.44,11.96 | v23.34,32.79 v30.25,32.79
RX0/PWMG  (via drill 0.33)
  Top 0.152: J401.4 29.21,28.55 R421.2 28.65,27.89 29.29,27.25 29.29,24.38 v29.69,23.98 | U401.21 35.79,23.85 v35.26,23.85
  Bottom 0.152: v35.26,23.85 35.13,23.98 v29.69,23.98
RX1  (via drill 0.33)
  Top 0.152: v29.74,22.23 29.74,22.78 28.45,22.78 U401.34 | v52.07,6.45 54.61,3.91 J404.6
  Bottom 0.152: v29.74,22.23 28.73,21.21 21.84,21.21 21.57,21.49 21.11,21.49 12.8,13.18 12.8,8.74 47.47,8.74 49.76,6.45 v52.07,6.45
SCK0  (via drill 0.33)
  Top 0.152: v29.77,27.66 30.18,28.07 31.5,28.07 32.79,26.77 U401.27 | U401.27 32.82,25.2 | U701.5 7.34,21.39 11.71,21.39 v17.98,27.66 | U401.27
  Bottom 0.152: v29.77,27.66 v17.98,27.66
SCK1  (via drill 0.33)
  Top 0.152: v30.89,20.9 30.89,15.75 30.71,15.57 30.71,15.29 29.97,15.29 29.62,15.65 29.62,16.03 29.34,16.31 U401.47 | v21.34,20.9 21.59,20.65 J406.6
  Bottom 0.152: v21.34,20.9 v30.89,20.9 | J402.4 10.26,5.18 11.94,5.18 12.8,6.04 12.8,7.52 20.42,7.52 J406.6
SCL0  (via drill 0.33)
  Top 0.152: U401.22 35.29,26.14 36.09,26.95 v36.09,27.36
  Bottom 0.152: v36.09,27.36 44.45,35.71 J002.1
SCL1  (via drill 0.33)
  Top 0.152: 26.72,16.26 27.1,16.26 27.1,12.42 28.6,10.92 v28.6,8.15 | 26.72,16.26 R401.6 | U401.37 30.48,21.31 30.94,21.77 v31.75,21.77 31.75,20.32 31.47,20.04 v31.47,17.3 | v26.72,16.18 26.72,16.26 | v40.23,32.87 40.46,32.64 40.46,25.68 v38.76,23.98
  Bottom 0.152: v28.6,8.15 29.23,7.52 30.58,7.52 J406.2 | v31.47,17.3 30.94,16.76 27.3,16.76 v26.72,16.18 | J002.3 40.23,35.97 v40.23,32.87 | v38.76,23.98 38.15,23.37 35.59,23.37 33.98,21.77 v31.75,21.77
SDA0
  Top 0.152: J002.2 33.29,28.21 U401.26
SDA1/BSL  (via drill 0.33)
  Top 0.152: v27.13,17.35 27.13,17.32 25.88,17.32 R401.8 | v30.25,17.35 29.49,18.11 29.49,19.3 U401.41 | v24.89,12.06 v24.89,13.82 | v32.87,9.93 34.29,8.51 J406.1 | J401.1 32.23,32.23 v32.23,29.18 | v20.93,25.04 20.42,24.54 v20.42,17.91
  Bottom 0.152: v30.25,17.35 v27.13,17.35 26.54,16.76 26.49,16.76 24.89,15.16 | v24.89,13.82 24.89,15.16 | v24.89,12.06 27.03,9.93 v32.87,9.93 | v20.93,25.04 22.17,26.29 31.11,26.29 32.23,27.41 v32.23,29.18 | v20.42,17.91 23.11,15.21 24.84,15.21 24.89,15.16
STOP  (via drill 0.33)
  Top 0.152: U401.46 28.44,16.76 27.41,16.76 | 27.41,16.76 R401.7 | v37.29,17.55 37.29,22.61 38.18,23.5 38.18,26.06 S420.P$2 | v28.63,12.06 27.64,13.06 27.64,15.32 27.41,15.54 27.41,16.76 | J403.10 35.76,4.88 27.84,4.88 27.84,10.87 v27.28,11.43
  Bottom 0.152: v37.29,17.55 41.3,13.54 41.3,12.06 v28.63,12.06 28.57,12.01 27.86,12.01 v27.28,11.43
TX0/PWMB  (via drill 0.33)
  Top 0.152: v28.35,34.54 28.35,29.44 28.57,29.21 R419.2 | v36.3,28.37 36.78,27.89 U401.19
  Bottom 0.152: v28.35,34.54 29.46,35.66 30.58,35.66 | J401.3 30.58,35.66 | v36.3,28.37 30.63,34.04 30.63,35.61 30.58,35.66
TX1/PWMR  (via drill 0.33)
  Top 0.152: 28.45,24.64 U401.33 | 28.45,24.64 28.45,26.54 28.57,26.67 R433.2 | v28.7,24.64 28.45,24.64 | v52.48,5.23 52.07,4.83 J404.5
  Bottom 0.152: v28.7,24.64 28.78,24.56 39.24,24.56 44.45,19.36 48.82,19.36 57.28,10.9 57.28,5.23 v52.48,5.23
USB_ON  (via drill 0.33)
  Top 0.152: R010.1 48.62,20.83 48.62,19.81 S010.P$1 48.54,19.76 48.54,18.9 v48.11,18.47 | v34.7,16.43 34.7,14.05 34.77,13.97 U401.58
  Bottom 0.152: v34.7,16.43 36.73,18.47 v48.11,18.47
USB_SOFTCONNECT  (via drill 0.33)
  Top 0.152: 49.35,33.55 R051.2 | Q050.1 49.35,34.54 49.64,34.25 R051.2 | v45.31,33.5 49.3,33.5 R051.2 | v37.87,26.57 37.8,26.49 U401.17
  Bottom 0.152: v45.31,33.5 38.38,26.57 v37.87,26.57
USBD+  (via drill 0.33)
  Top 0.152: C030.1 49.66,28.19 49.66,26.92 R030.1 49.58,26.9 v48.03,25.35 | U401.10 40.95,20.32 41.45,20.83 v41.45,24.49
  Bottom 0.152: v48.03,25.35 47.17,24.49 v41.45,24.49
USBD-  (via drill 0.33)
  Top 0.152: C020.1 49.66,25.65 49.66,24.38 R020.1 49.58,24.36 v48.21,24.36 | U401.11 39.65,20.83 40.72,20.83 v40.72,23.9
  Bottom 0.152: v48.21,24.36 47.75,23.9 v40.72,23.9
VBUS  (via drill 0.33)
  Top 0.152: J001.VBUS 53.87,24.05 51.89,24.05 51,23.16 R011.2 50.95,23.11 50.95,21.84 R010.2 50.95,21.79 v50.95,20.88 | 47.12,20.07 C302.1 | 45.54,21.34 D302.1 | R302.2 44.37,29.29 44.37,22.53 45.54,22.53 | 45.49,21.41 D302.1 | U301.4 45.54,24.33 45.54,22.53 | J404.2 46.99,3.81 46.99,11.99 46.86,12.12 46.86,20.22 C302.1 | 45.54,22.53 45.54,21.36 D302.1 | C302.1 46.48,20.07 v46.48,21.08 45.8,21.08 arc-90 D302.1
  Bottom 0.152: 50.9,20.93 v50.95,20.88 46.69,20.88 v46.48,21.08
VCC  (via drill 0.33)
  Top 0.152: U401.43 28.42,18.29 C443.1 25.4,18.29 25.4,17.78 R401.1 R401.2 R401.3 R401.4 24.97,15.65 24.97,15.32 v25.78,14.5 | U402.1 24.75,24.06 C432.1 24.71,25.45 23.93,26.24 23.93,33.02 22.12,34.82 | C451.1 31.29,12.12 U401.51 31.29,14.02 v31.29,15.27 | U401.23 34.79,26.49 | 34.79,26.49 34.79,27.35 C423.1 | 37.29,15.27 U401.63 | J401.6 22.12,34.82 | v34.72,26.49 34.79,26.49 | 6.93,20.27 7.11,20.27 U701.4 | C701.1 6.22,27.18 6.15,27.1 6.15,20.27 U701.4 | U701.4 7.19,20.22 13.21,20.22 | 30.28,13.97 U401.49 30.23,14.02 30.23,14.73 30.12,14.83 v29.62,14.83 | v36.7,15.27 37.29,15.27 | 50.95,33.27 R051.1 | Q050.2 51.23,34.54 50.94,34.25 R051.1 | C201.1 59.94,9.4 57.18,9.4 | 48.82,8.59 U202.3 48.77,8.57 v48.77,9.4 | J404.3 48.95,3.23 v48.95,5.23 | v41.07,11.48 41.07,12.04 40.18,12.04 C463.1 40.13,15.27 | v41.43,25.32 42.04,24.71 42.04,19.36 41.68,19 C407.1 41.53,18.81 U401.7 39.57,18.77 38.58,18.77 38.58,16.84 39.57,16.84 U401.3 39.65,16.79 40.66,16.79 40.66,15.27 40.13,15.27 | 13.21,20.22 15.95,20.22 19.62,23.88 S401.2 19.62,32.32 22.12,34.82 | J406.11 13.21,10.67 13.21,20.22 | 37.29,15.27 40.13,15.27 | R051.1 53.59,33.27 57.3,29.57 57.3,18.34 56.74,17.78 arc90 56.64,17.68 v56.64,9.4 57.18,9.4 | 57.18,9.4 U201.5
  Bottom 0.152: J401.6 27,33.96 30.28,33.96 34.72,29.52 v34.72,26.49 35.89,25.32 v41.43,25.32 | v25.78,14.5 29.29,14.5 v29.62,14.83 30.05,15.27 v31.29,15.27 31.88,15.85 36.12,15.85 v36.7,15.27 | v48.95,5.23 49.58,5.87 52.3,5.87 52.65,6.22 52.65,9.4 | v41.07,11.48 41.12,11.43 46.33,11.43 48.34,9.42 48.34,9.4 v48.77,9.4 52.32,9.4 52.65,9.4 | 52.65,9.4 v56.64,9.4
VIN+  (via drill 0.33)
  Top 0.152: U202.5 45.21,7.62 45.21,6.99 44.96,6.99 R203.1 v44.96,6.1 | v48.79,23.44 D302.3
  Bottom 0.152: v48.79,23.44 50.47,21.77 51.31,21.77 58.75,14.33 58.75,4.65 46.41,4.65 v44.96,6.1
VIN-  (via drill 0.33)
  Top 0.152: 42.42,8.26 R201.2 | U202.4 46.18,8.56 46.18,8.38 44.96,8.38 R203.2 | 44.98,8.33 R203.2 | S201.3 44.91,16.46 42.98,14.53 42.98,10.46 42.42,9.91 | v50.39,4.06 50.39,6.33 50.06,6.66 Q201.2 | v39.62,7.54 39.62,9.91 42.42,9.91 | R201.2 42.42,7.62 44.7,7.62 44.7,8.27 R203.2 | 42.42,9.91 R201.2
  Bottom 0.152: v50.39,4.06 48.77,2.44 44.68,2.44 | 44.68,2.44 43.08,2.44 J404.1 | v39.62,7.54 44.68,2.49 44.68,2.44
VLIPO  (via drill 0.33)
  Top 0.152: v46.28,22.5 47.42,21.36 D302.2 | v44.96,23.32 45.01,23.37 45.01,26.44 45.52,26.95 U301.3 45.54,27.03 45.54,27.91 C301.1 | 54.03,12.98 53.98,12.98 J301.2 55.02,12.97 v55.02,13.97
  Bottom 0.152: v44.96,23.32 45.47,23.32 v46.28,22.5 47.32,21.46 51.18,21.46 55.02,17.63 v55.02,13.97
XTAL1
  Top 0.152: U401.62 36.79,12.74 36.83,12.7 36.95,12.7 Y401.3 37.57,12.08 C462.2
XTAL2
  Top 0.152: U401.61 36.29,10.63 Y401.1 35.07,10.78 C461.2

### Text on the board
tPlace: VCC | GND | RX0 | TX0 | RST | BSL | SDA1 | SCL1 | SCL0 | SDA0 | CHARGE | USB | STOP | BOOT | ON | RESET | GND | 11DoF | MISO1 | SCK1 | MOSI1 | CS1 | GND | AD8 | AD7 | AD6 | AD5 | AD4 | AD3 | AD2 | AD1 | STOP | VBAT | VBUS | VCC | GND | TX1 | RX1
bPlace: VCC | GND | RX0 | TX0 | RST | SDA1 | BSL | SCL1 | SCL0 | SDA0 | Project Candace | St Kwan's Home for | the Terminally ADD | Loginator v1.1 | a division of Kwan Systems | stkwans.blogspot.com | 13 Apr 2012 | GND | VCC | CSA | IA | MISO | MOSI | SCK | IG | CSG | CI | SCL1 | SDA1 | 11DoF | MISO1 | SCK1 | MOSI1 | CS1 | GND | AD8 | AD7 | AD6 | AD5 | AD4 | AD3 | AD2 | AD1 | STOP | VBAT | VBUS | VCC | GND | TX1 | RX1
Document: Released under the Creative Commons Attribution Share-Alike 3.0 License | http://creativecommons.org/licenses/by-sa/3.0 | Original design by C. Taylor and N. Seidle, Sparkfun Electronics http://www.sparkfun.com/products/10216 | Heavily modified by C. Jeppesen, St Kwan's Home for the Terminally ADD, stkwans.blogspot.com